# Altium schematic sheet Audio.SchDoc
size A4
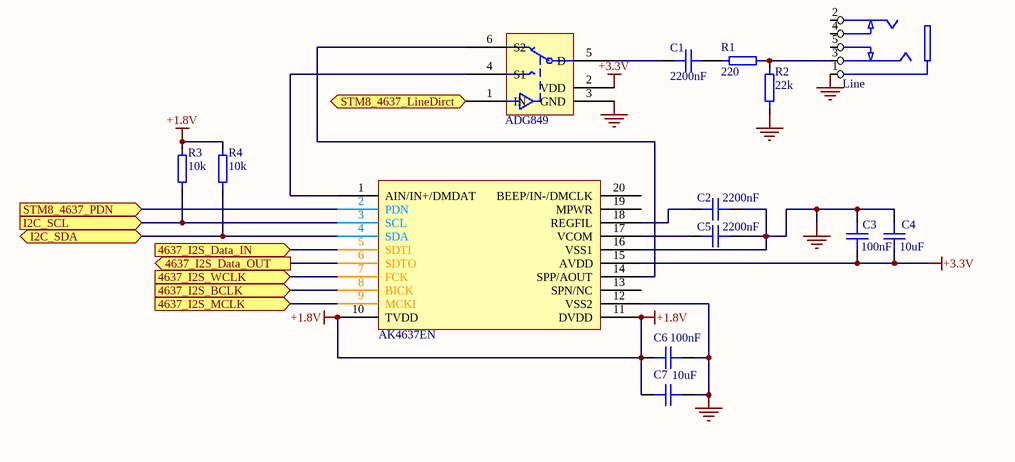
[diagram p0: Audio.SchDoc]

## Parts
ADG849  ADG849  [ADG849]  (value not drawn)
AK4637EN  AK4637EN  [AK4637EN]  (value not drawn)
C1  value 2200nF  [SMD 0402]  (hidden comment: Capacity SMD)
C2  value 2200nF  [SMD 0402]  (hidden comment: Capacity SMD)
C3  value 100nF  [SMD 0402]  (hidden comment: Capacity SMD)
C4  value 10uF  [SMD 0402]  (hidden comment: Capacity SMD)
C5  value 2200nF  [SMD 0402]  (hidden comment: Capacity SMD)
C6  value 100nF  [SMD 0402]  (hidden comment: Capacity SMD)
C7  value 10uF  [SMD 0402]  (hidden comment: Capacity SMD)
Line  Audio Jack  [Audio Jack PJ-328]  (value not drawn)
R1  value 220  [SMD 0402]  (hidden comment: Resistor SMD)
R2  value 22k  [SMD 0402]  (hidden comment: Resistor SMD)
R3  value 10k  [SMD 0402]  (hidden comment: Resistor SMD)
R4  value 10k  [SMD 0402]  (hidden comment: Resistor SMD)

## Ports
4637_I2S_BCLK (in), 4637_I2S_Data_IN (in), 4637_I2S_Data_OUT (out), 4637_I2S_MCLK (in), 4637_I2S_WCLK (in), I2C_SCL (in), I2C_SDA (bidir), STM8_4637_LineDirct (in), STM8_4637_PDN (in)

## Nets
+1.8V: AK4637EN.10(TVDD) AK4637EN.11(DVDD) C6.1 C7.1 R3.2 R4.2
+3.3V: ADG849.2(VDD) AK4637EN.15(AVDD) C3.1 C4.1
GND: ADG849.3(GND) AK4637EN.12(VSS2) AK4637EN.16(VSS1) C2.2 C3.2 C4.2 C5.2 C6.2 C7.2 Line.1(GND) R2.1
4637_I2S_BCLK: AK4637EN.8(BICK) ; port 4637_I2S_BCLK
4637_I2S_Data_IN: AK4637EN.5(SDTI) ; port 4637_I2S_Data_IN
4637_I2S_Data_OUT: AK4637EN.6(SDTO) ; port 4637_I2S_Data_OUT
4637_I2S_MCLK: AK4637EN.9(MCKI) ; port 4637_I2S_MCLK
4637_I2S_WCLK: AK4637EN.7(FCK) ; port 4637_I2S_WCLK
I2C_SCL: AK4637EN.3(SCL) R3.1 ; port I2C_SCL
I2C_SDA: AK4637EN.4(SDA) R4.1 ; port I2C_SDA
STM8_4637_LineDirct: ADG849.1(IN) ; port STM8_4637_LineDirct
STM8_4637_PDN: AK4637EN.2(PDN) ; port STM8_4637_PDN
NetADG849_4: ADG849.4(S1) AK4637EN.1(AIN/IN+/DMDAT)
NetADG849_5: ADG849.5(D) C1.1
NetADG849_6: ADG849.6(S2) AK4637EN.14(SPP/AOUT)
NetAK4637EN_17: AK4637EN.17(VCOM) C5.1
NetAK4637EN_18: AK4637EN.18(REGFIL) C2.1
NetC1_2: C1.2 R1.1
NetLine_3: Line.3(LEFT) R1.2 R2.2

Not connected (* = marked no-connect by the designer): AK4637EN 13(SPN/NC) 19(MPWR) 20(BEEP/IN-/DMCLK); Line 2(RIGHT) 4(RIGHT_SW) 5(LEFT_SW)

## Library data of the parts
Line = Audio Jack PJ-328: Type: PJ-328
ADG849 = ADG849: FootPrint: 6-Pin SC70
AK4637EN = AK4637EN: FootPrint: 20-pin QFN